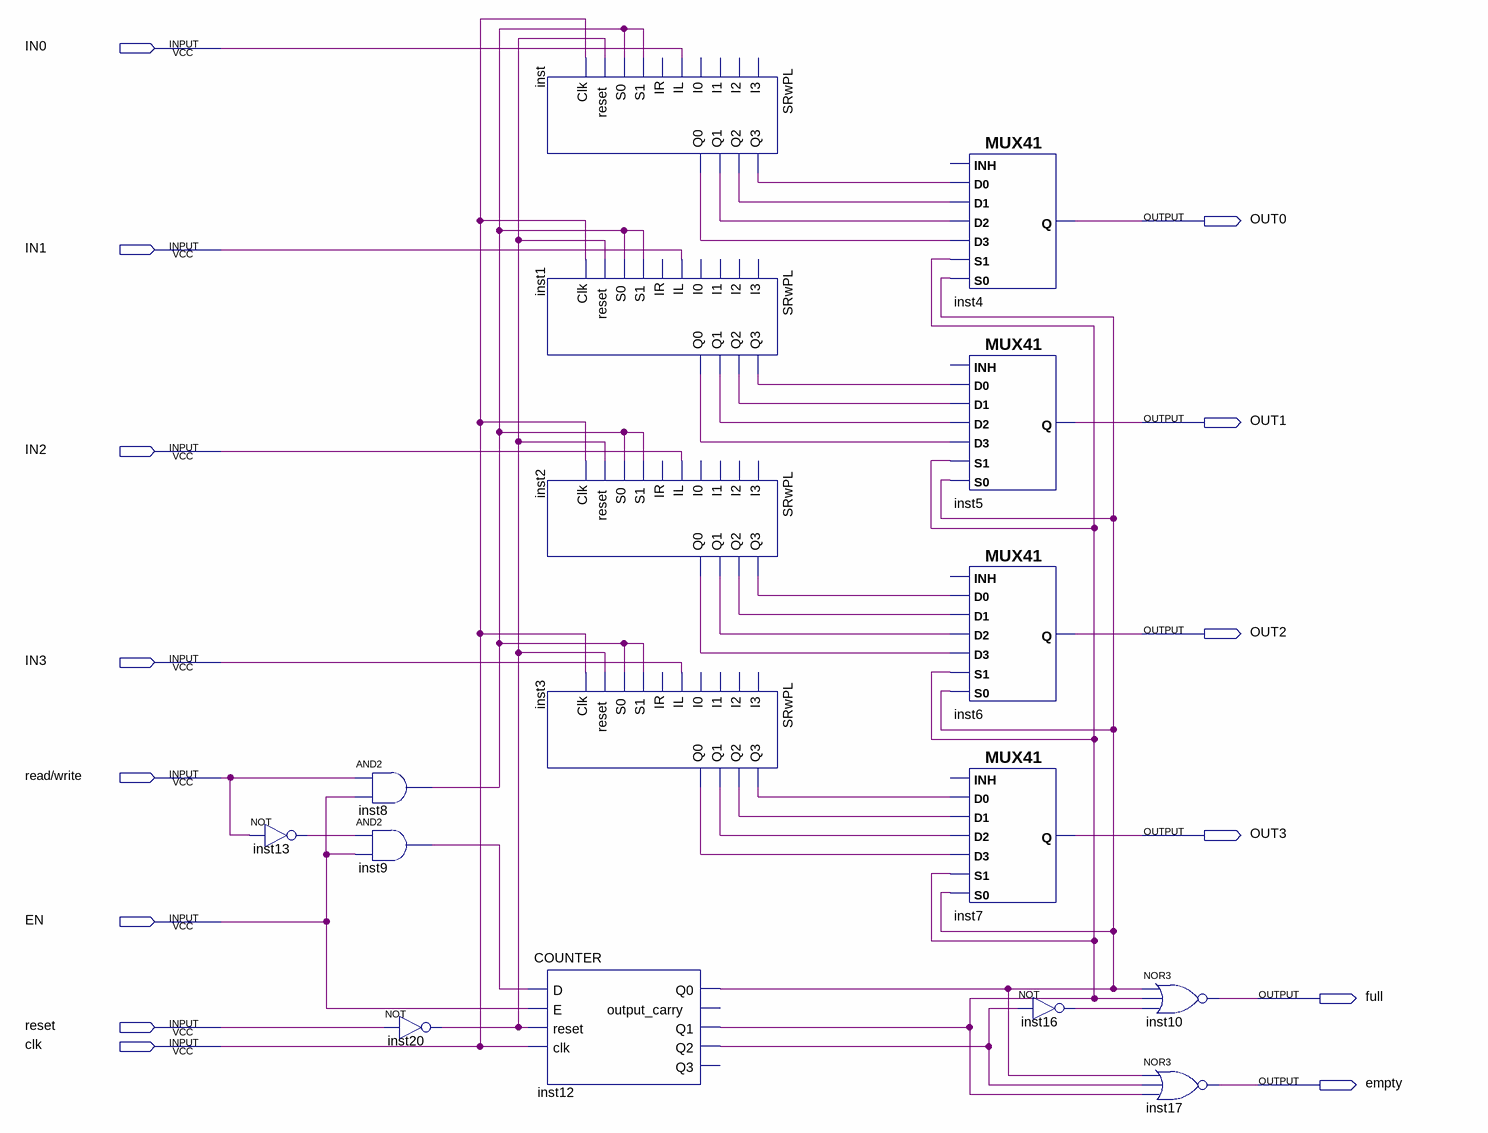
[diagram p0: schematic sheet]
// Quartus schematic FIFO.bdf as structural Verilog: 16 symbols, 14 pins
module FIFO (
  input  IN0,
  input  IN1,
  input  IN2,
  input  IN3,
  input  \read/write ,
  input  EN,
  input  reset,
  input  clk,
  output OUT0,
  output OUT1,
  output OUT2,
  output OUT3,
  output full,
  output empty
);

  wire inst1_q0, inst1_q1, inst1_q2, inst1_q3, inst2_q0, inst2_q1, inst2_q2, inst2_q3, inst3_q0, inst3_q1,
       inst3_q2, inst3_q3, inst8_out, inst9_out, inst12_q0, inst12_q1, inst12_q2, inst13_out, inst16_out,
       inst20_out, inst_q0, inst_q1, inst_q2, inst_q3;

  not inst13 (inst13_out, \read/write );
  and inst8 (inst8_out, \read/write , EN);
  and inst9 (inst9_out, inst13_out, EN);
  not inst20 (inst20_out, reset);
  SRwPL inst (
    .IL(IN0), .S1(inst8_out), .S0(inst8_out), .reset(inst20_out), .Clk(clk), .Q3(inst_q3), .Q2(inst_q2),
    .Q1(inst_q1), .Q0(inst_q0));  // open: I3, I2, I1, I0, IR
  SRwPL inst1 (
    .IL(IN1), .S1(inst8_out), .S0(inst8_out), .reset(inst20_out), .Clk(clk), .Q3(inst1_q3), .Q2(inst1_q2),
    .Q1(inst1_q1), .Q0(inst1_q0));  // open: I3, I2, I1, I0, IR
  SRwPL inst2 (
    .IL(IN2), .S1(inst8_out), .S0(inst8_out), .reset(inst20_out), .Clk(clk), .Q3(inst2_q3), .Q2(inst2_q2),
    .Q1(inst2_q1), .Q0(inst2_q0));  // open: I3, I2, I1, I0, IR
  SRwPL inst3 (
    .IL(IN3), .S1(inst8_out), .S0(inst8_out), .reset(inst20_out), .Clk(clk), .Q3(inst3_q3), .Q2(inst3_q2),
    .Q1(inst3_q1), .Q0(inst3_q0));  // open: I3, I2, I1, I0, IR
  COUNTER inst12 (
    .D(inst9_out), .E(EN), .reset(inst20_out), .clk(clk), .Q0(inst12_q0), .Q1(inst12_q1), .Q2(inst12_q2));  // open: output_carry, Q3
  MUX41 inst4 (
    .S0(inst12_q0), .D2(inst_q1), .S1(inst12_q1), .D3(inst_q0), .D0(inst_q3), .D1(inst_q2), .Q(OUT0));  // open: INH
  MUX41 inst5 (
    .S0(inst12_q0), .D2(inst1_q1), .S1(inst12_q1), .D3(inst1_q0), .D0(inst1_q3), .D1(inst1_q2), .Q(OUT1));  // open: INH
  MUX41 inst6 (
    .S0(inst12_q0), .D2(inst2_q1), .S1(inst12_q1), .D3(inst2_q0), .D0(inst2_q3), .D1(inst2_q2), .Q(OUT2));  // open: INH
  MUX41 inst7 (
    .S0(inst12_q0), .D2(inst3_q1), .S1(inst12_q1), .D3(inst3_q0), .D0(inst3_q3), .D1(inst3_q2), .Q(OUT3));  // open: INH
  not inst16 (inst16_out, inst12_q2);
  nor inst10 (full, inst12_q0, inst12_q1, inst16_out);
  nor inst17 (empty, inst12_q0, inst12_q2, inst12_q1);
endmodule
